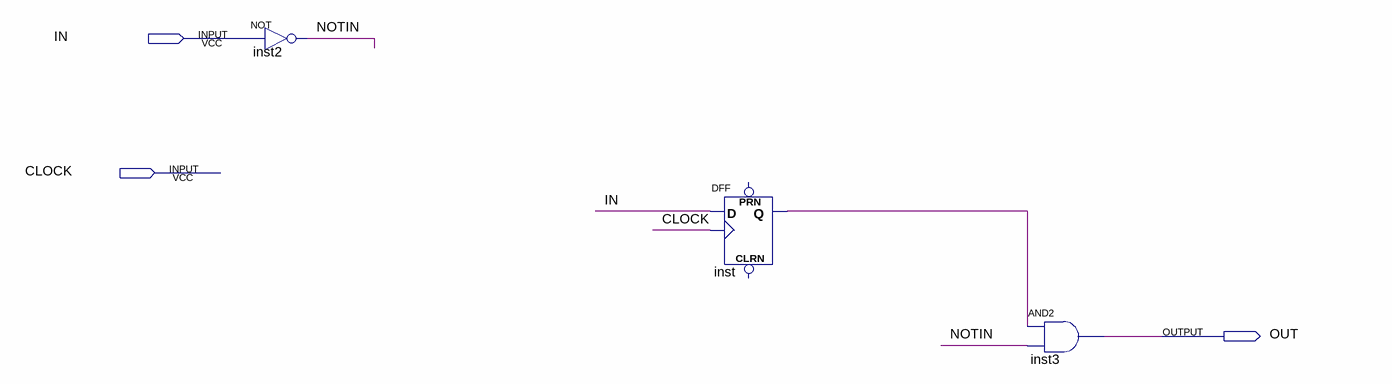
[diagram p0: schematic sheet]
// Quartus schematic fallingedge.bdf as structural Verilog: 3 symbols, 3 pins
module fallingedge (
  input  IN,
  input  CLOCK,
  output OUT
);

  wire inst_q, NOTIN;

  not inst2 (NOTIN, IN);
  DFF inst (.CLK(CLOCK), .D(IN), .Q(inst_q));  // open: CLRN, PRN
  and inst3 (OUT, inst_q, NOTIN);
endmodule
